# EAGLE design shieldv2 (EAGLE 6.4)
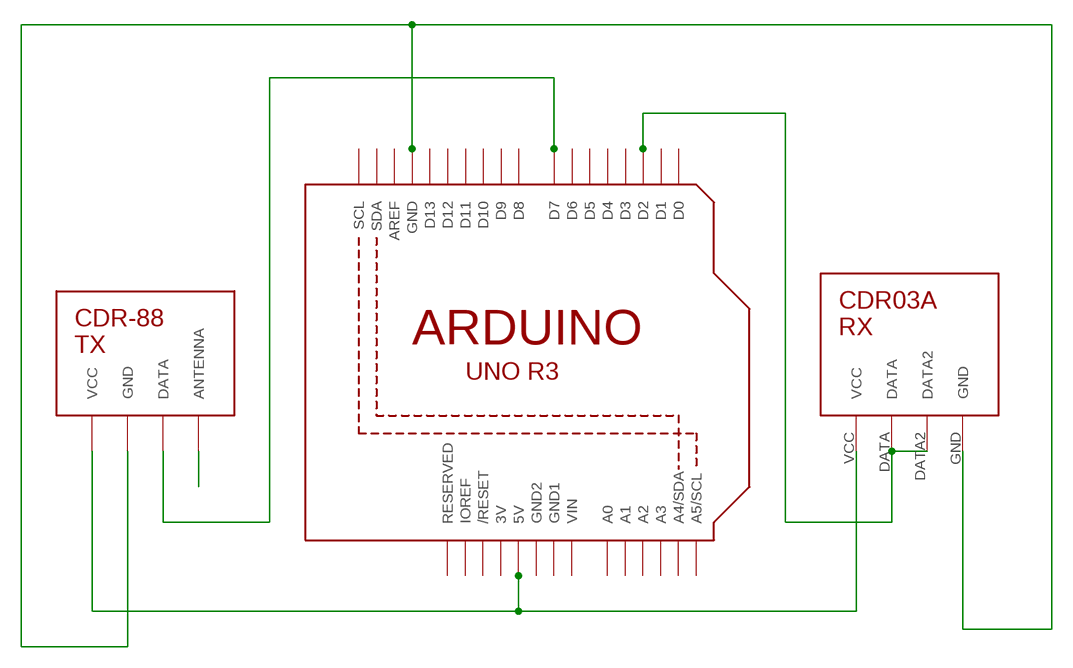
[diagram p0: schematic, sheet 1]

## Parts
U2  ARDUINOR3-DIMENSION  [ARDUINOR3]
U$1  CDT-88  [CDT-88]
U$2  CDR03A  [CDR03A]

## Nets
N$1: U2.D7 U$1.DATA
N$2: U2.D2 U$2.DATA U$2.DATA2
N$5: U2.5V U$1.VCC U$2.VCC
N$7: U$1.ANTENNA
N$69: U2.GND U$1.GND U$2.GND
Unconnected: U2.A0 U2.A1 U2.A2 U2.A3 U2.A4(A4/SDA) U2.A5(A5/SCL) U2.AREF U2.D0 U2.D1 U2.D3 U2.D4 U2.D5 U2.D6 U2.D8 U2.D9 U2.D10 U2.D11 U2.D12 U2.D13 U2.IOREF U2.RESERVED U2.RESET(/RESET) U2.SCL U2.SDA

## Power pins joined to a net without a drawn wire
3V: U2.3V
GND1: U2.GND1
GND2: U2.GND2
VIN: U2.VIN

## Library data of the parts
U2 = adafruit:ARDUINOR3: This is a new object for the new Arduino R3 - with extra pins that you may want to use (such as IOref, and duplicated A4/A5
U$1 = RF-transrec:CDT-88
U$2 = RF-transrec:CDR03A

## Board
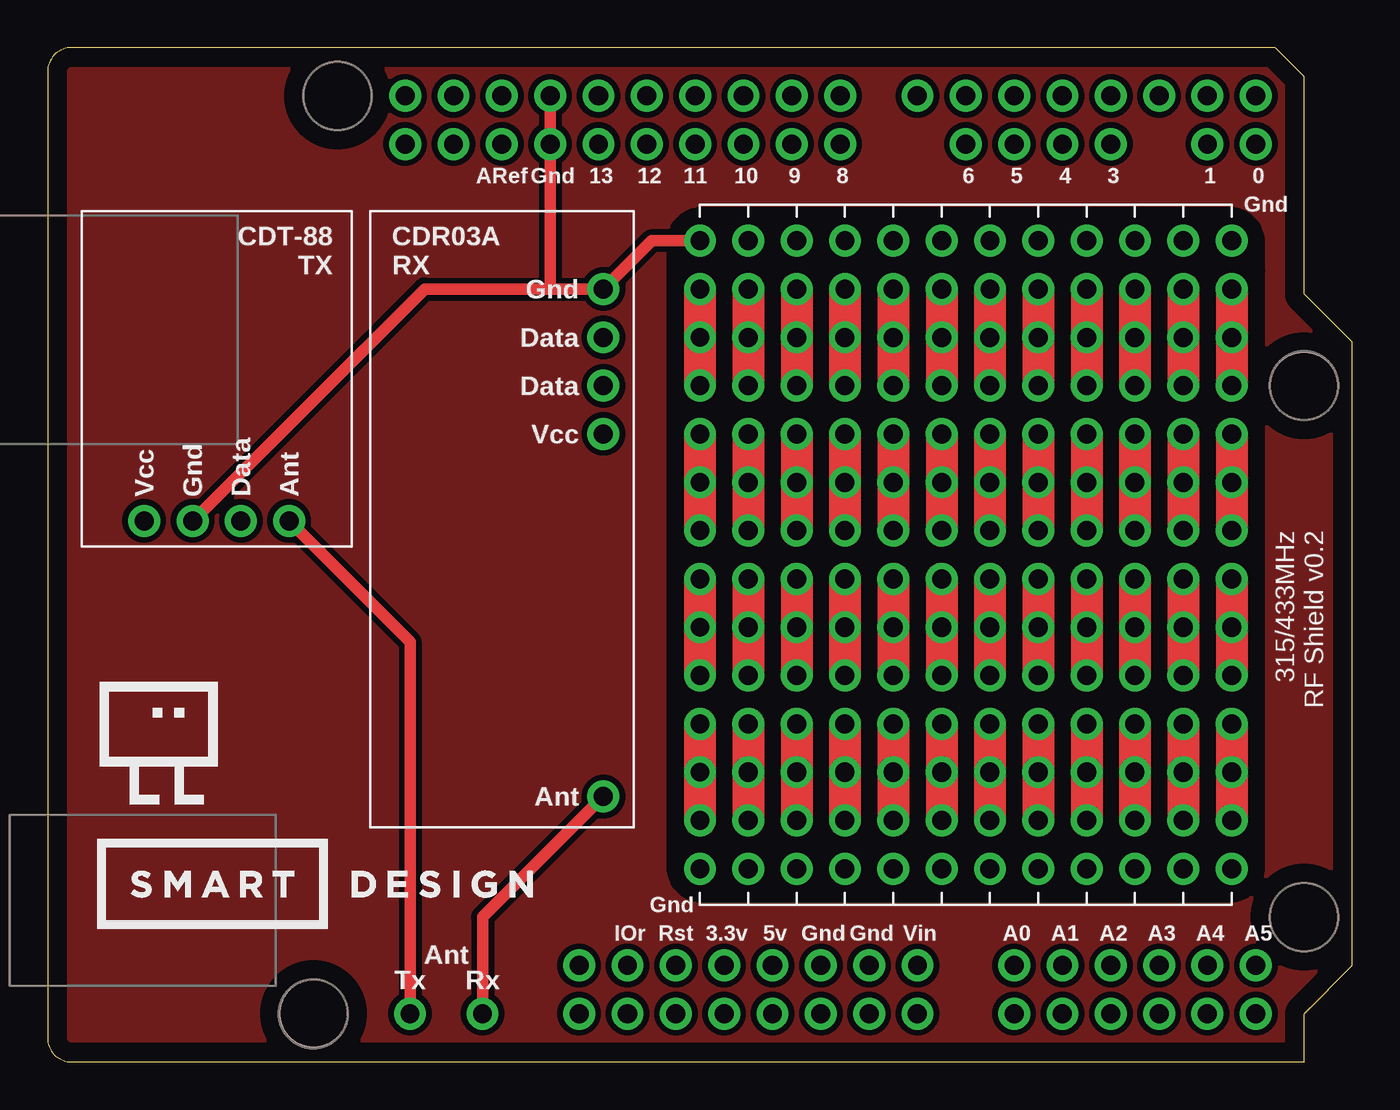
[diagram p1: board, top side]
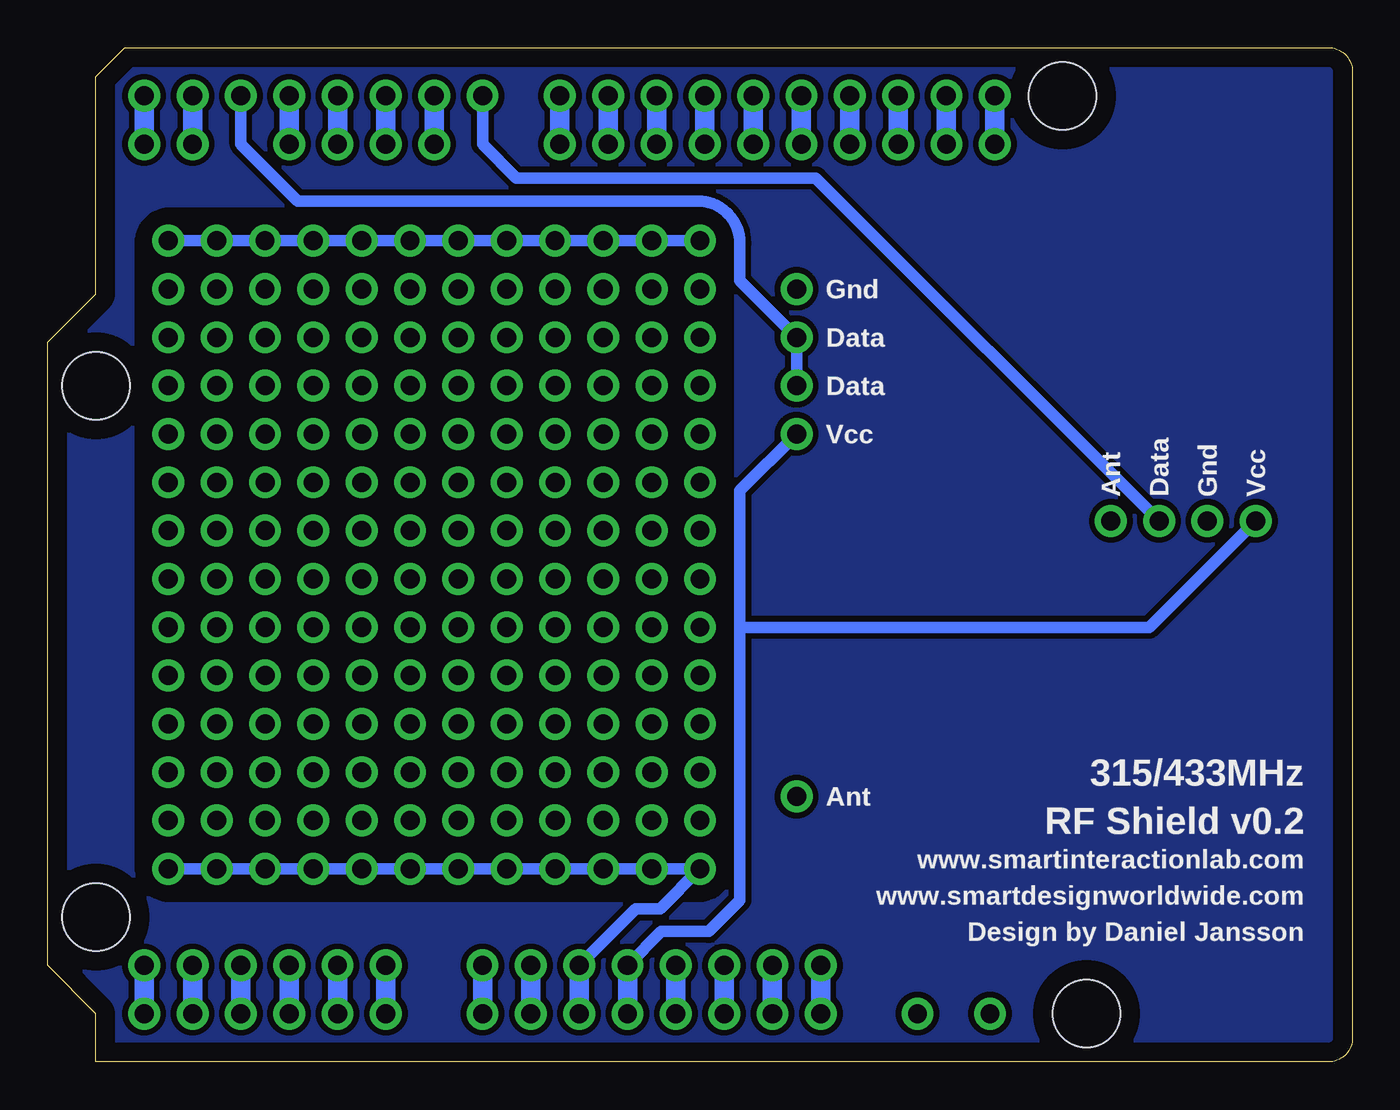
[diagram p2: board, bottom side, seen from below]

Size 68.58 x 53.34 mm. Coordinates in mm from the lower left corner, seen from the top.
Copper layers (1*16): Top 0.035mm / dielectric 1.5mm / Bottom 0.035mm
Design rules "default": minimum track width 10mil, minimum drill 24mil, track to track 8mil, track to pad 8mil, pad to pad 8mil, via to via 8mil, smd to smd 8mil, copper to edge 40mil, drill to drill 8mil, minimum pad ring 10mil, minimum via ring 8mil, stop-mask expansion 4mil, vias tented up to drill 0mil, thermal gap 10mil
Holes 3.56 mm at 13.97,2.54 66.04,7.62 66.04,35.56 15.24,50.8
tKeepout: 48 lines

### Footprints (pad centres in the part's own frame; a part is rotated, then mirrored left to right if it is on the bottom)
ARDUINOR3 = drill 1 pad 1.676: 3V 35.56,2.54; 5V 38.1,5.08; A0 50.8,2.54; A1 53.34,2.54; A2 55.88,2.54; A3 58.42,2.54; A4 60.96,2.54; A5 63.5,2.54; AREF 23.876,50.8; D0 63.5,50.8; D1 60.96,50.8; D2 58.42,50.8; D3 55.88,50.8; D4 53.34,50.8; D5 50.8,50.8; D6 48.26,50.8; D7 45.72,50.8; D8 41.656,50.8; D9 39.116,50.8; D10 36.576,50.8; D11 34.036,50.8; D12 31.496,50.8; D13 28.956,50.8; GND 26.416,50.8; GND1 43.18,2.54; GND2 40.64,5.08; IOREF 30.48,2.54; RESERVED 27.94,2.54; RESET 33.02,2.54; SCL 18.796,50.8; SDA 21.336,50.8; VIN 45.72,2.54 | drill 0.991 pad 1.676: P$1 27.94,5.08; P$2 30.48,5.08; P$3 33.02,5.08; P$4 35.56,5.08; P$5 38.1,2.54; P$6 40.64,2.54; P$7 43.18,5.08; P$8 45.72,5.08; P$9 50.8,5.08; P$10 53.34,5.08; P$11 55.88,5.08; P$12 58.42,5.08; P$13 60.96,5.08; P$14 63.5,5.08; P$15 63.5,48.26; P$16 60.96,48.26; P$18 55.88,48.26; P$19 53.34,48.26; P$20 50.8,48.26; P$21 48.26,48.26; P$23 41.656,48.26; P$24 39.116,48.26; P$25 36.576,48.26; P$26 34.036,48.26; P$27 31.496,48.26; P$28 28.956,48.26; P$29 26.416,48.26; P$30 23.876,48.26; P$31 21.336,48.26; P$32 18.796,48.26
CDT-88 = drill 1 pad 1.676: ANTENNA 7.62,0; DATA 5.08,0; GND 2.54,0; VCC 0,0
CDR03A = drill 1 pad 1.676: DATA 2.54,0; DATA2 5.08,0; GND 7.62,0; P$2 -19.06,0; VCC 0,0

### Placement (x,y rotation side)
U2  0,0 0 top
U$1  5.08,28.45 0 top
U$2  29.21,33.02 90 top

### Tracks (layer width: path | path; a pad name or v marks a point on that pad's centre or on a via)
GND
  pour Top (isolate 0.305): 66.04,0 1.27,0 arc-90 0,1.27 0,52.07 arc-90 1.27,53.34 64.45,53.34 66.04,51.75 66.04,41.66 64.14,41.66 64.14,43.08 arc90 62.13,45.09 34.39,45.09 arc90 32.39,43.08 32.39,10.26 arc90 34.39,8.26 62.13,8.26 arc90 64.14,10.26 64.14,41.54 66.04,41.54 66.04,40.32 68.58,37.78 68.58,5.08 66.04,2.54
  pour Bottom (isolate 0.305): 66.04,0 1.27,0 arc-90 0,1.27 0,52.07 arc-90 1.27,53.34 64.45,53.34 66.04,51.75 66.04,41.66 64.14,41.66 64.14,43.08 arc90 62.13,45.09 34.39,45.09 arc90 32.39,43.08 32.39,10.26 arc90 34.39,8.26 62.13,8.26 arc90 64.14,10.26 64.14,41.54 66.04,41.54 66.04,40.32 68.58,37.78 68.58,5.08 66.04,2.54
GND2
  Bottom 0.13: U2.GND2 40.64,2.54
  Bottom 0.61: 62.23,10.16 34.29,10.16 36.39,8.06 37.66,8.06 U2.GND2
N$1
  Bottom 0.61: U2.D7 45.72,48.26 43.94,46.48 28.19,46.48 U$1.DATA
N$2
  Bottom 0.61: U2.D2 58.42,48.26 55.44,45.27 34.42,45.27 arc90 32.2,43.05 32.2,41.08 U$2.DATA2 U$2.DATA
N$3  (via drill 1 pad 1.68)
  other vias: 36.83,10.16
N$4  (via drill 0.99 pad 1.68)
  Top 0.61: 29.21,13.97 22.86,7.62 v22.86,2.54
N$5
  Bottom 0.61: U$2.VCC 32.2,30.04 32.2,22.86 | 32.2,22.86 32.2,8.51 33.84,6.86 36.32,6.86 U2.5V | U$1.VCC 10.67,22.86 32.2,22.86
N$6  (via drill 1 pad 1.68)
  other vias: 39.37,10.16
N$7  (via drill 0.99 pad 1.68)
  Top 0.61: U$1.ANTENNA 19.05,22.1 v19.05,2.54
N$8  (via drill 1 pad 1.68)
  other vias: 41.91,10.16
N$9  (via drill 1 pad 1.68)
  other vias: 44.45,10.16
N$10  (via drill 1 pad 1.68)
  other vias: 46.99,10.16
N$11  (via drill 1 pad 1.68)
  other vias: 49.53,10.16
N$12  (via drill 1 pad 1.68)
  other vias: 54.61,10.16
N$13  (via drill 1 pad 1.68)
  other vias: 52.07,10.16
N$14  (via drill 1 pad 1.68)
  other vias: 57.15,10.16
N$15  (via drill 1 pad 1.68)
  other vias: 59.69,10.16
N$16  (via drill 1 pad 1.68)
  other vias: 62.23,10.16
N$17  (via drill 0.99 pad 1.68, 1 pad 1.68)
  Top 1.676: v39.37,40.64 v39.37,38.1 v39.37,35.56
N$18  (via drill 0.99 pad 1.68, 1 pad 1.68)
  Top 1.676: v41.91,40.64 v41.91,38.1 v41.91,35.56
N$19  (via drill 0.99 pad 1.68, 1 pad 1.68)
  Top 1.676: v44.45,40.64 v44.45,38.1 v44.45,35.56
N$20  (via drill 0.99 pad 1.68, 1 pad 1.68)
  Top 1.676: v46.99,40.64 v46.99,38.1 v46.99,35.56
N$21  (via drill 0.99 pad 1.68, 1 pad 1.68)
  Top 1.676: v49.53,40.64 v49.53,38.1 v49.53,35.56
N$22  (via drill 0.99 pad 1.68, 1 pad 1.68)
  Top 1.676: v52.07,40.64 v52.07,38.1 v52.07,35.56
N$23  (via drill 0.99 pad 1.68, 1 pad 1.68)
  Top 1.676: v54.61,40.64 v54.61,38.1 v54.61,35.56
N$24  (via drill 0.99 pad 1.68, 1 pad 1.68)
  Top 1.676: v57.15,40.64 v57.15,38.1 v57.15,35.56
N$25  (via drill 0.99 pad 1.68, 1 pad 1.68)
  Top 1.676: v59.69,40.64 v59.69,38.1 v59.69,35.56
N$26  (via drill 0.99 pad 1.68, 1 pad 1.68)
  Top 1.676: v62.23,40.64 v62.23,38.1 v62.23,35.56
N$49  (via drill 1 pad 1.68)
  Top 1.676: v36.83,17.78 v36.83,15.24 v36.83,12.7
N$50  (via drill 1 pad 1.68)
  Top 1.676: v39.37,17.78 v39.37,15.24 v39.37,12.7
N$51  (via drill 1 pad 1.68)
  Top 1.676: v41.91,17.78 v41.91,15.24 v41.91,12.7
N$52  (via drill 1 pad 1.68)
  Top 1.676: v44.45,17.78 v44.45,15.24 v44.45,12.7
N$53  (via drill 1 pad 1.68)
  Top 1.676: v46.99,17.78 v46.99,15.24 v46.99,12.7
N$54  (via drill 1 pad 1.68)
  Top 1.676: v49.53,17.78 v49.53,15.24 v49.53,12.7
N$55  (via drill 1 pad 1.68)
  Top 1.676: v52.07,17.78 v52.07,15.24 v52.07,12.7
N$56  (via drill 1 pad 1.68)
  Top 1.676: v54.61,17.78 v54.61,15.24 v54.61,12.7
N$57  (via drill 1 pad 1.68)
  Top 1.676: v57.15,17.78 v57.15,15.24 v57.15,12.7
N$58  (via drill 1 pad 1.68)
  Top 1.676: v59.69,17.78 v59.69,15.24 v59.69,12.7
N$59  (via drill 1 pad 1.68)
  Top 1.676: v62.23,17.78 v62.23,15.24 v62.23,12.7
N$62  (via drill 1 pad 1.68)
  Top 1.676: v36.83,25.4 v36.83,22.86 v36.83,20.32
N$65  (via drill 1 pad 1.68)
  Top 1.676: v36.83,33.02 v36.83,30.48 v36.83,27.94
N$68  (via drill 1 pad 1.68)
  Top 1.676: v36.83,40.64 v36.83,38.1 v36.83,35.56
N$69  (via drill 0.99 pad 1.68)
  Top 0.254: 26.42,40.64
  Top 0.61: U$1.GND 19.81,40.64 26.42,40.64 U$2.GND 31.75,43.18 v34.29,43.18 | U2.GND 26.42,40.64
  Bottom 0.61: v62.23,43.18 v59.69,43.18 v57.15,43.18 v54.61,43.18 v52.07,43.18 v49.53,43.18 v46.99,43.18 v44.45,43.18 v41.91,43.18 v39.37,43.18 v36.83,43.18 v34.29,43.18
N$70  (via drill 0.99 pad 1.68)
  Top 1.676: v34.29,40.64 v34.29,38.1 v34.29,35.56
N$73  (via drill 0.99 pad 1.68)
  Top 1.676: v34.29,33.02 v34.29,30.48 v34.29,27.94
N$76  (via drill 0.99 pad 1.68)
  Top 1.676: v34.29,25.4 v34.29,22.86 v34.29,20.32
N$79  (via drill 0.99 pad 1.68)
  Top 1.676: v34.29,17.78 v34.29,15.24 v34.29,12.7
N$85  (via drill 1 pad 1.68)
  Top 1.676: v62.23,33.02 v62.23,30.48 v62.23,27.94
N$88  (via drill 1 pad 1.68)
  Top 1.676: v62.23,25.4 v62.23,22.86 v62.23,20.32
N$109  (via drill 1 pad 1.68)
  Top 1.676: v59.69,25.4 v59.69,22.86 v59.69,20.32
N$110  (via drill 1 pad 1.68)
  Top 1.676: v57.15,25.4 v57.15,22.86 v57.15,20.32
N$111  (via drill 1 pad 1.68)
  Top 1.676: v54.61,25.4 v54.61,22.86 v54.61,20.32
N$112  (via drill 1 pad 1.68)
  Top 1.676: v52.07,25.4 v52.07,22.86 v52.07,20.32
N$113  (via drill 1 pad 1.68)
  Top 1.676: v49.53,25.4 v49.53,22.86 v49.53,20.32
N$114  (via drill 1 pad 1.68)
  Top 1.676: v46.99,25.4 v46.99,22.86 v46.99,20.32
N$115  (via drill 1 pad 1.68)
  Top 1.676: v44.45,25.4 v44.45,22.86 v44.45,20.32
N$116  (via drill 1 pad 1.68)
  Top 1.676: v41.91,25.4 v41.91,22.86 v41.91,20.32
N$117  (via drill 1 pad 1.68)
  Top 1.676: v39.37,25.4 v39.37,22.86 v39.37,20.32
N$136  (via drill 1 pad 1.68)
  Top 1.676: v39.37,33.02 v39.37,30.48 v39.37,27.94
N$137  (via drill 1 pad 1.68)
  Top 1.676: v41.91,33.02 v41.91,30.48 v41.91,27.94
N$138  (via drill 1 pad 1.68)
  Top 1.676: v44.45,33.02 v44.45,30.48 v44.45,27.94
N$139  (via drill 1 pad 1.68)
  Top 1.676: v46.99,33.02 v46.99,30.48 v46.99,27.94
N$140  (via drill 1 pad 1.68)
  Top 1.676: v49.53,33.02 v49.53,30.48 v49.53,27.94
N$141  (via drill 1 pad 1.68)
  Top 1.676: v52.07,33.02 v52.07,30.48 v52.07,27.94
N$142  (via drill 1 pad 1.68)
  Top 1.676: v54.61,33.02 v54.61,30.48 v54.61,27.94
N$143  (via drill 1 pad 1.68)
  Top 1.676: v57.15,33.02 v57.15,30.48 v57.15,27.94
N$144  (via drill 1 pad 1.68)
  Top 1.676: v59.69,33.02 v59.69,30.48 v59.69,27.94
N$159  (via drill 0.99 pad 1.68)
  other vias: 34.29,10.16

### Text on the board
tPlace: Gnd | 315/433MHz / RF Shield v0.2 | Gnd | Ant | Tx | Rx
bPlace: Gnd | Data | Data | Vcc | Vcc | Gnd | Data | Ant | 315/433MHz | Ant | RF Shield v0.2 | www.smartinteractionlab.com | www.smartdesignworldwide.com | Design by Daniel Jansson